# Altium project IoT_Hackathon.PrjPcb
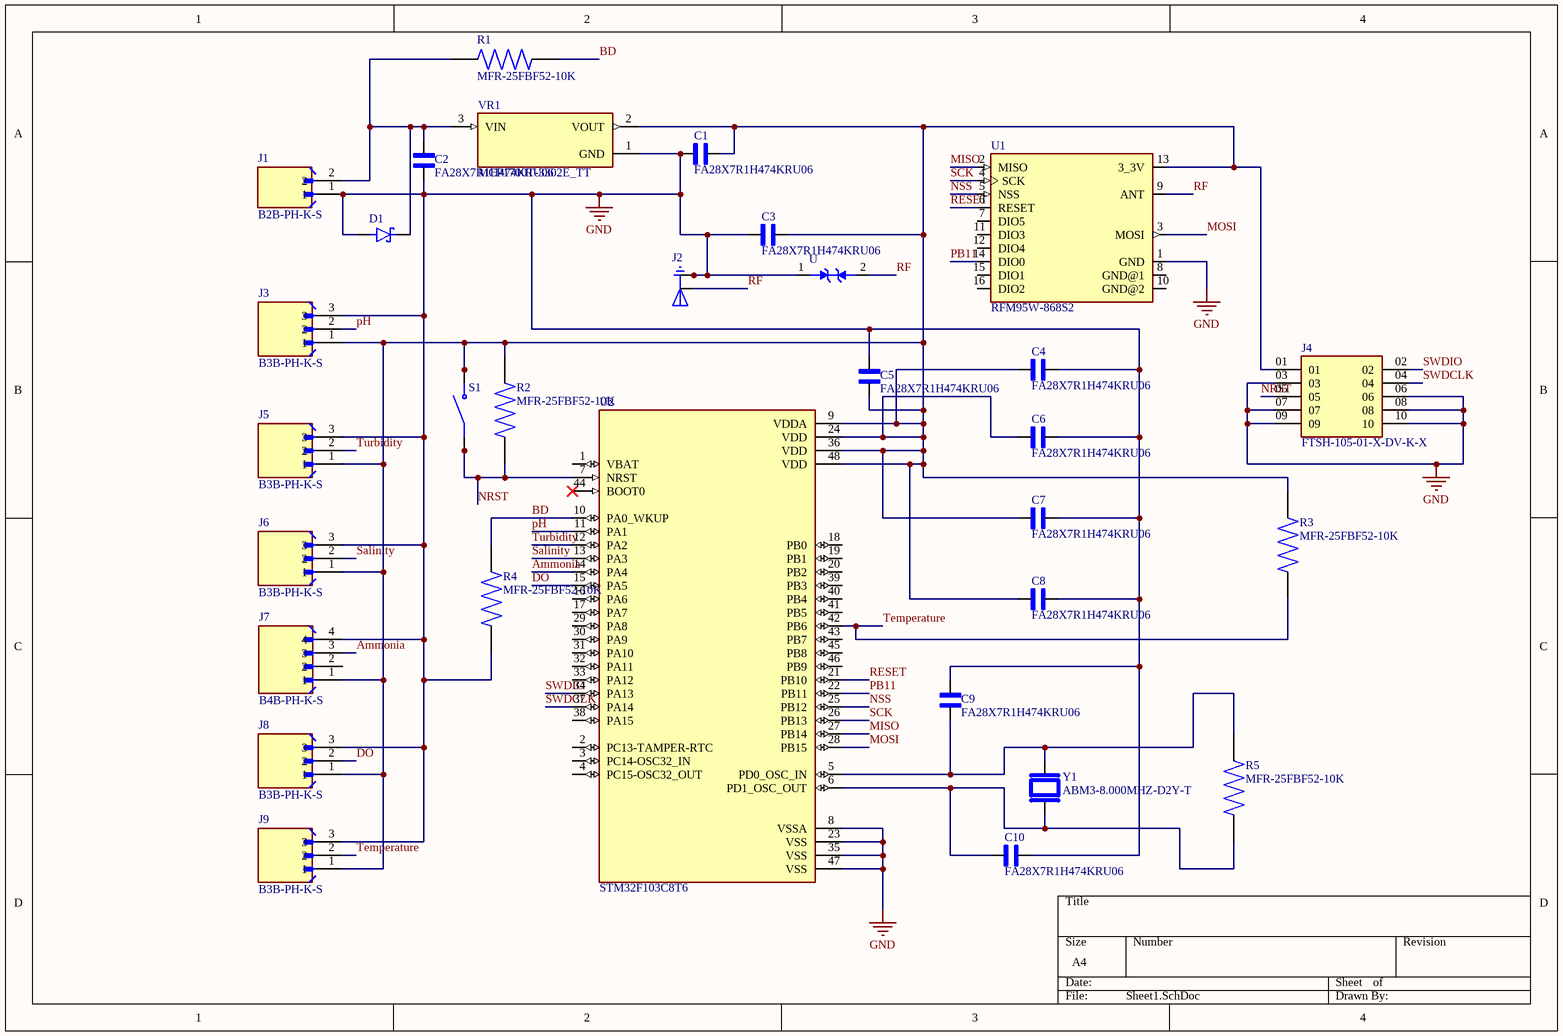
[diagram p0: Sheet1.SchDoc]
1 sheet, 31 parts. Net scope: global (net labels, ports and power ports of the same name join across sheets).
Board file: PCB1.PcbDoc

## Sheet Sheet1.SchDoc
size A4; SheetNumber: 1; SheetTotal: 1

### Parts
C1  FA28X7R1H474KRU06  [CAPRB500W50L400T250H550]
C2  FA28X7R1H474KRU06  [CAPRB500W50L400T250H550]
C3  FA28X7R1H474KRU06  [CAPRB500W50L400T250H550]
C4  FA28X7R1H474KRU06  [CAPRB500W50L400T250H550]
C5  FA28X7R1H474KRU06  [CAPRB500W50L400T250H550]
C6  FA28X7R1H474KRU06  [CAPRB500W50L400T250H550]
C7  FA28X7R1H474KRU06  [CAPRB500W50L400T250H550]
C8  FA28X7R1H474KRU06  [CAPRB500W50L400T250H550]
C9  FA28X7R1H474KRU06  [CAPRB500W50L400T250H550]
C10  FA28X7R1H474KRU06  [CAPRB500W50L400T250H550]
D1  SS14  [DIOM4325X250N]  (value not drawn)
J1  B2B-PH-K-S  [JST_B2B-PH-K-S]
J2  U.FL-R-SMT-1(10)  [HRS_U.FL-R-SMT-1(10)]  (value not drawn)
J3  B3B-PH-K-S  [JST_B3B-PH-K-S]
J4  FTSH-105-01-X-DV-K-X  [SAMTEC_FTSH-105-01-X-DV-K-X]
J5  B3B-PH-K-S  [JST_B3B-PH-K-S]
J6  B3B-PH-K-S  [JST_B3B-PH-K-S]
J7  B4B-PH-K-S  [JST_B4B-PH-K-S]
J8  B3B-PH-K-S  [JST_B3B-PH-K-S]
J9  B3B-PH-K-S  [JST_B3B-PH-K-S]
R1  MFR-25FBF52-10K  [RESAD1100W55L680D260]
R2  MFR-25FBF52-10K  [RESAD1100W55L680D260]
R3  MFR-25FBF52-10K  [RESAD1100W55L680D260]
R4  MFR-25FBF52-10K  [RESAD1100W55L680D260]
R5  MFR-25FBF52-10K  [RESAD1100W55L680D260]
S1  TS-1187A-B-A-B  [SW_TS-1187A-B-A-B]  (value not drawn)
U  ESD9B5.0ST5G  [SODFL1006X40N]  (value not drawn)
U1  RFM95W-868S2  [XCVR_RFM95W-868S2]
U2  STM32F103C8T6  [QFP50P900X900X160-48N]
VR1  MCP1700T-3302E_TT  [SOT95P237X112-3N]
Y1  ABM3-8.000MHZ-D2Y-T  [XTAL_ABM3-8.000MHZ-D2Y-T]

### Nets
GND: C1.1 C2.1 C3.1 C4.2 C5.2 C6.2 C7.2 C8.2 C9.2 C10.2 D1.A J1.1 J2.1(GND) J2.3(GND) J3.3 J4.03 J4.06 J4.07 J4.08 J4.09 J4.10 J5.3 J6.3 J7.4 J8.3 J9.3 R4.1 U.1(A) U1.1(GND) U2.8(VSSA) U2.23(VSS) U2.35(VSS) U2.47(VSS) VR1.1(GND)
Ammonia: J7.3 U2.14(PA4)
BD: R1.2 R4.2 U2.10(PA0_WKUP)
DO: J8.2 U2.15(PA5)
MISO: U1.2(MISO) U2.27(PB14)
MOSI: U1.3(MOSI) U2.28(PB15)
NRST: J4.05 R2.1 S1.A(COM) S1.B(COM) U2.7(NRST)
NSS: U1.5(NSS) U2.25(PB12)
PB11: U1.14(DIO0) U2.22(PB11)
pH: J3.2 U2.11(PA1)
RESET: U1.6(RESET) U2.21(PB10)
RF: J2.2(SIG) U.2(A1) U1.9(ANT)
Salinity: J6.2 U2.13(PA3)
SCK: U1.4(SCK) U2.26(PB13)
SWDCLK: J4.04 U2.37(PA14)
SWDIO: J4.02 U2.34(PA13)
Temperature: J9.2 R3.1 U2.42(PB6)
Turbidity: J5.2 U2.12(PA2)
NetC1_2: C1.2 C3.2 C4.1 C5.1 C6.1 C7.1 C8.1 J3.1 J4.01 J5.1 J6.1 J7.1 J8.1 J9.1 R2.2 R3.2 S1.C(NO) S1.D(NO) U1.13(3_3V) U2.9(VDDA) U2.24(VDD) U2.36(VDD) U2.48(VDD) VR1.2(VOUT)
NetC2_2: C2.2 D1.C(K) J1.2 R1.1 VR1.3(VIN)
NetC9_1: C9.1 R5.2 U2.5(PD0_OSC_IN) Y1.1
NetC10_1: C10.1 R5.1 U2.6(PD1_OSC_OUT) Y1.2

Not connected (* = marked no-connect by the designer): J7 2; U1 7(DIO5) 8(GND@1) 10(GND@2) 11(DIO3) 12(DIO4) 15(DIO1) 16(DIO2); U2 1(VBAT) 2(PC13-TAMPER-RTC) 3(PC14-OSC32_IN) 4(PC15-OSC32_OUT) 16(PA6) 17(PA7) 18(PB0) 19(PB1) 20(PB2) 29(PA8) 30(PA9) 31(PA10) 32(PA11) 33(PA12) 38(PA15) 39(PB3) 40(PB4) 41(PB5) 43(PB7) 44(BOOT0)* 45(PB8) 46(PB9)

### Library data of the parts
C1-C10 = FA28X7R1H474KRU06: 0.47 ÂµF Â±10% 50V Ceramic Capacitor X7R Radial; MF: TDK; SnapEDA_Link: https://www.snapeda.com/parts/FA28X7R1H474KRU06/TDK/view-part/?ref=snap; Package: RADIAL-2 TDK; Value: *; MP: FA28X7R1H474KRU06; Check_prices: https://www.snapeda.com/parts/FA28X7R1H474KRU06/TDK/view-part/?ref=eda
D1 = SS14: 1A, 40V, Schottky Rectifier; MF: Taiwan Semiconductor; SnapEDA_Link: https://www.snapeda.com/parts/SS14/taiwan/view-part/?ref=snap; Package: SMA-2 Taiwan Semiconductor; Value: *; MP: SS14; Check_prices: https://www.snapeda.com/parts/SS14/taiwan/view-part/?ref=eda
J1 = B2B-PH-K-S: Connector Header Through Hole 2 position 0.079 (2.00mm); MF: JST Sales America Inc.; SnapEDA_Link: https://www.snapeda.com/parts/B2B-PH-K-S/JST/view-part/?ref=snap; Package: None; Value: *; MP: B2B-PH-K-S; Check_prices: https://www.snapeda.com/parts/B2B-PH-K-S/JST/view-part/?ref=eda
J2 = U.FL-R-SMT-1(10): U.FL Series 6 Ghz 50 Ohm Ultra-small SMT Coaxial Cable Receptacle; Availability: Unavailable; MP: U.FL-R-SMT-1(10); Value: *; Price: None; Package: None
J3 J5 J6 J8 J9 = B3B-PH-K-S: MF: {'manufacturer': u'JST Sales America Inc.'}; Package: None; Price: None; Value: *; MP: B3B-PH-K-S; Availability: Unavailable
J4 = FTSH-105-01-X-DV-K-X: MF: {'manufacturer': u'Samtec Inc.'}; Package: None; Price: None; Value: *; MP: FTSH-105-01-X-DV-K-X; Availability: Unavailable
J7 = B4B-PH-K-S: MF: {'manufacturer': u'JST Sales America Inc.'}; Package: None; Price: None; Value: *; MP: B4B-PH-K-S; Availability: Unavailable
R1-R5 = MFR-25FBF52-10K: 10.2 kOhms Â±1% 0.25W, 1/4W Through Hole Resistor Axial - Metal Film; MF: Yageo; SnapEDA_Link: https://www.snapeda.com/parts/MFR-25FBF52-10K/Yageo/view-part/?ref=snap; Package: RADIAL-2 YAGEO; Value: *; MP: MFR-25FBF52-10K; Check_prices: https://www.snapeda.com/parts/MFR-25FBF52-10K/Yageo/view-part/?ref=eda
S1 = TS-1187A-B-A-B: SPST 50mA @ 12VDC Top Actuated Round Button 160gf SMD Tactile Switches RoHS; MP: TS-1187A-B-A-B; Value: *; Price: None; Package: None; Availability: Unavailable
U = ESD9B5.0ST5G: Clamp Ipp Tvs Diode Surface Mount SOD-923; MF: ON Semiconductor; Price: None; Availability: Unavailable; Package: SOD-923 ON Semiconductor; SnapEDA_Link: https://www.snapeda.com/parts/ESD9B5.0ST5G/ON%20Semiconductor/view-part/239806/?ref=snap; MP: ESD9B5.0ST5G; Value: *
U1 = RFM95W-868S2: General ISM < 1GHz LoRaâ„¢ Transceiver Module 868MHz Antenna Not Included Surface Mount; MF: RF; Package: Non Standard RF Solutions; Price: None; Check_prices: https://www.snapeda.com/parts/RFM95W-868S2/RF+Solutions/view-part/?ref=eda; Value: *; SnapEDA_Link: https://www.snapeda.com/parts/RFM95W-868S2/RF+Solutions/view-part/?ref=snap; MP: RFM95W-868S2; Availability: In Stock; Purchase-URL: https://pricing.snapeda.com/search?q=RFM95W-868S2&ref=eda
U2 = STM32F103C8T6: ARM® Cortex®-M3 STM32F1 Microcontroller IC 32-Bit 72MHz 64KB (64K x 8) FLASH 48-LQFP (7x7); MF: STMicroelectronics; SnapEDA_Link: https://www.snapeda.com/parts/STM32F103C8T6/STMicroelectronics/view-part/?ref=snap; Package: LQFP-48 STMicroelectronics; Value: *; MP: STM32F103C8T6; Check_prices: https://www.snapeda.com/parts/STM32F103C8T6/STMicroelectronics/view-part/?ref=eda
VR1 = MCP1700T-3302E_TT: Pwr Sply Func,Voltage Regulator,LDO,SOT-23,PD 369.6mW,VO 3.3V,Regline +/-0.75%/V | Microchip Technology Inc. MCP1700T-3302E/TT; SnapEDA_Link: https://www.snapeda.com/parts/MCP1700T-3302E/TT/Microchip/view-part/?ref=snap; Package: SOT-23 Microchip; Value: *; MF: Microchip; MP: MCP1700T-3302E/TT; Check_prices: https://www.snapeda.com/parts/MCP1700T-3302E/TT/Microchip/view-part/?ref=eda
Y1 = ABM3-8.000MHZ-D2Y-T: 8 MHz Â±20ppm Crystal 18pF 140 Ohms 2-SMD, No Lead; MF: Abracon; Purchase-URL: https://pricing.snapeda.com/search/part/ABM3-8.000MHZ-D2Y-T/?ref=eda; MP: ABM3-8.000MHZ-D2Y-T; SnapEDA_Link: https://www.snapeda.com/parts/ABM3-8.000MHZ-D2Y-T/Abracon+LLC/view-part/?ref=snap; Value: *; Package: SMD-2 Abracon; Price: None; Availability: In Stock; Check_prices: https://www.snapeda.com/parts/ABM3-8.000MHZ-D2Y-T/Abracon+LLC/view-part/?ref=eda